# EAGLE design tdr (EAGLE 9.1.1)
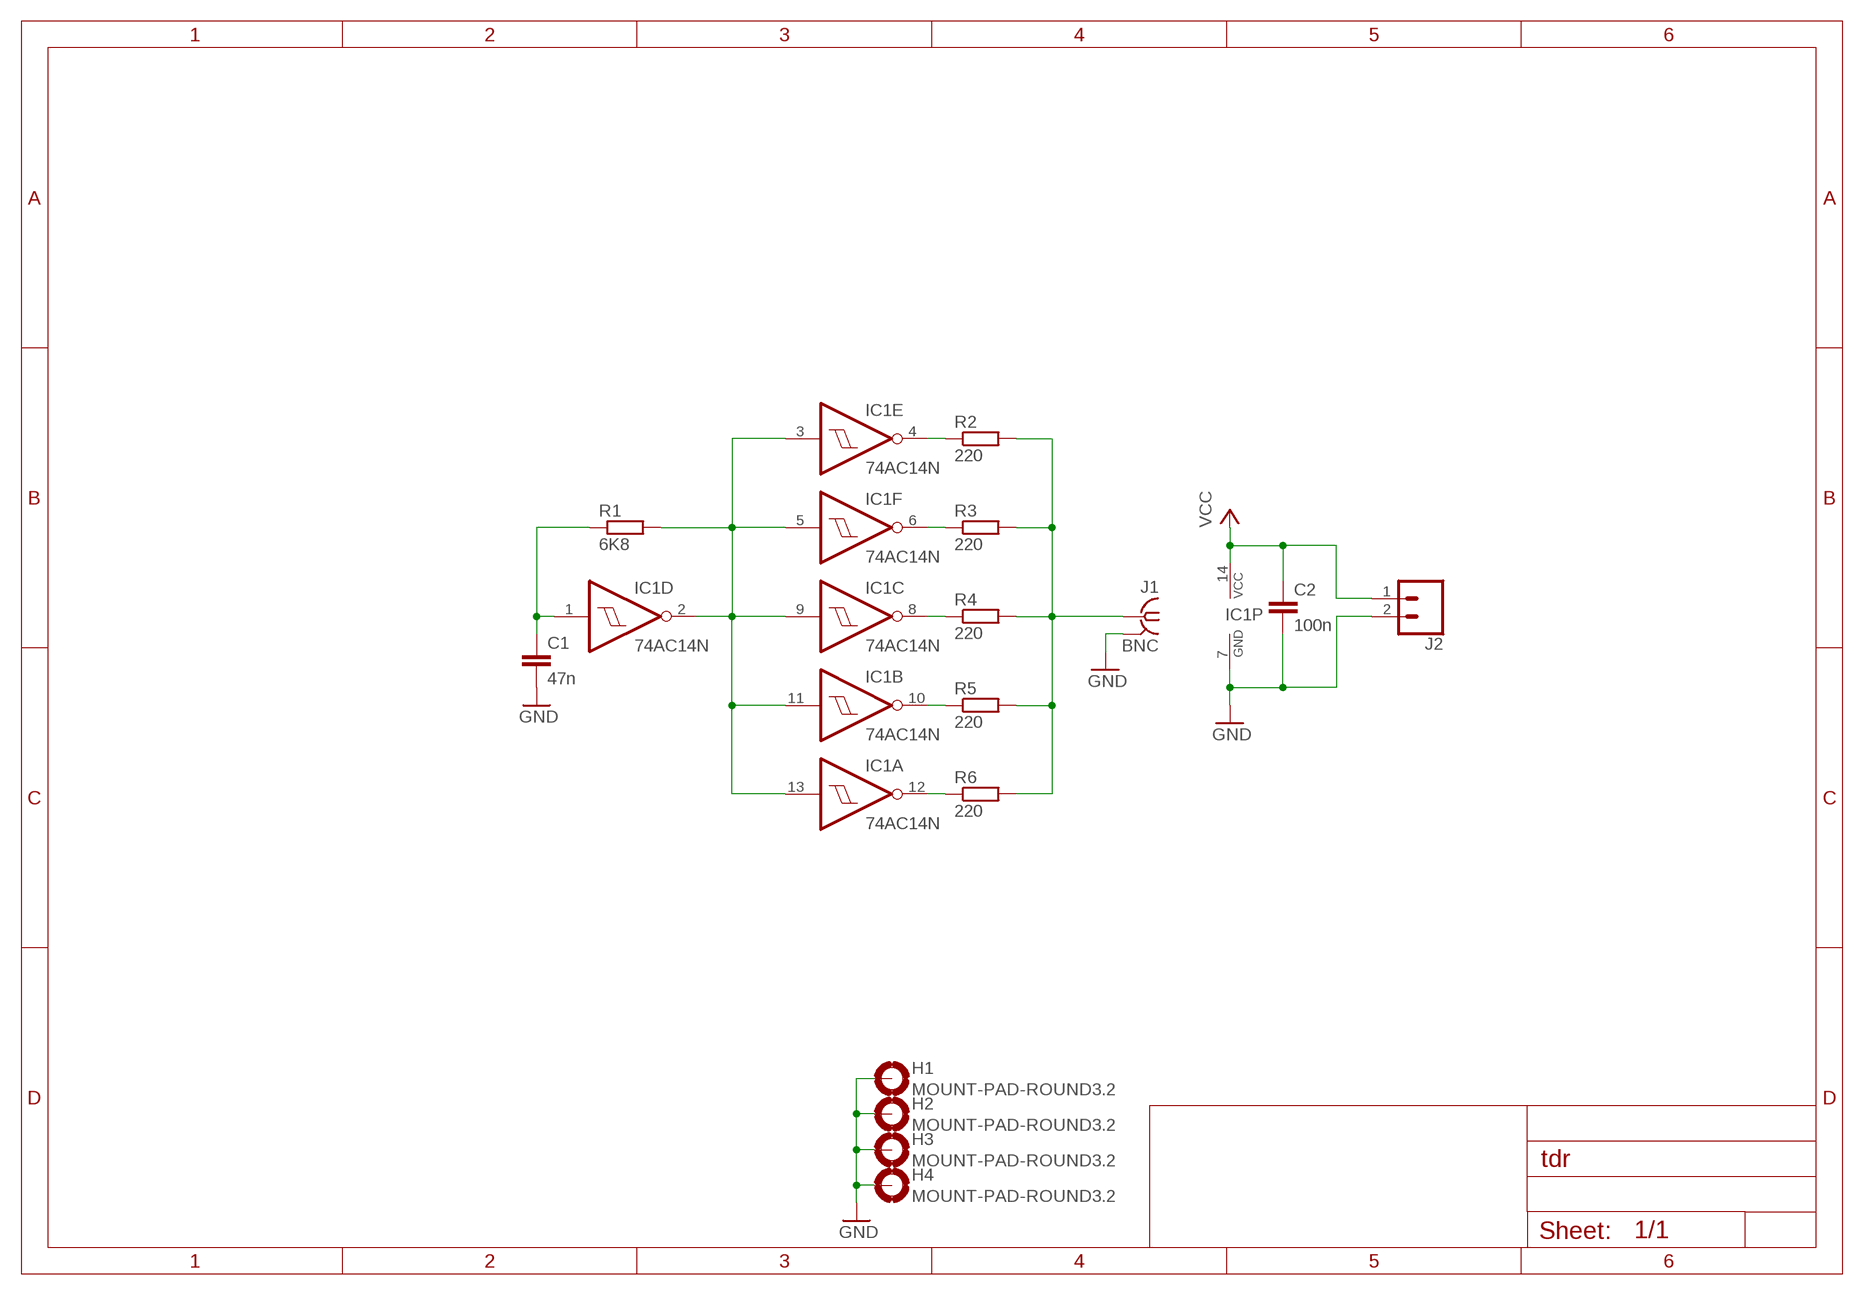
[diagram p0: schematic, sheet 1]

## Parts
C1  47n  C-EU075-032X103  [C075-032X103]
C2  100n  C-EU075-032X103  [C075-032X103]
H1  MOUNT-PAD-ROUND3.2  [3,2-PAD]
H2  MOUNT-PAD-ROUND3.2  [3,2-PAD]
H3  MOUNT-PAD-ROUND3.2  [3,2-PAD]
H4  MOUNT-PAD-ROUND3.2  [3,2-PAD]
IC1  74AC14N  [DIL14]
J1  BNC  [BNC_TYCO]
J2  CONN_023.5MM  [SCREWTERMINAL-3.5MM-2]
R1  6K8  R-EU_0207/10  [0207/10]
R2  220  R-EU_0207/10  [0207/10]
R3  220  R-EU_0207/10  [0207/10]
R4  220  R-EU_0207/10  [0207/10]
R5  220  R-EU_0207/10  [0207/10]
R6  220  R-EU_0207/10  [0207/10]

## Nets
GND: C1.2 C2.2 H1.B3,2(MOUNT) H2.B3,2(MOUNT) H3.B3,2(MOUNT) H4.B3,2(MOUNT) IC1.7(P:GND) J1.G(GND) J2.2
N$1: C1.1 IC1.1(D:I) R1.1
N$2: IC1.2(D:O) IC1.3(E:I) IC1.5(F:I) IC1.9(C:I) IC1.11(B:I) IC1.13(A:I) R1.2
N$3: IC1.4(E:O) R2.1
N$4: IC1.6(F:O) R3.1
N$5: IC1.8(C:O) R4.1
N$6: IC1.10(B:O) R5.1
N$7: IC1.12(A:O) R6.1
N$8: J1.C R2.2 R3.2 R4.2 R5.2 R6.2
VCC: C2.1 IC1.14(P:VCC) J2.1

## Library data of the parts
C1 C2 = rcl:C-EU: CAPACITOR, European symbol; SPICEPREFIX: C
H1-H4 = AZT-HOLES:MOUNT-PAD-ROUND: MOUNTING PAD, round
IC1 = 74xx-eu:74*14: Hex schmitt trigger INVERTER
J1 = AZT-RF:BNC
J2 = AZT-CONN:CONN_02: Multi connection point. Often used as Generic Header-pin footprint for 0.1 inch spaced/style header connections On any of the 0.1 inch spaced packages, you can populate with these: Break Away Headers - Straight <https://www.sparkfun.com/products/116> (PRT-00116) Break Away Male Headers - Right Angle <https://www.sparkfun.com/products/553> (PRT-00553) Female Headers <https://www.sparkfun.com/products/115> (PRT-00115) Break Away Headers - Machine Pin <https://www.sparkfun.com/products/117> (PRT-00117) Break Away Female Headers - Swiss Machine Pin <https://www.sparkfun.com/products/743> (PRT-00743) For SCREWTERMINALS and SPRING TERMINALS visit here: Screw Terimnals on SparkFun.com <https://www.sparkfun.com/search/results?term=Screw+Terminals> (5mm/3.5mm/2.54mm spacing) This device is also useful as a general connection point to wire up your design to another part of your project. Our various solder wires solder well into these plated through hole pads. Hook-Up Wire - Assortment (Stranded, 22 AWG) <https://www.sparkfun.com/products/11375> (PRT-11375) Hook-Up Wire - Assortment (Solid Core, 22 AWG) <https://www.sparkfun.com/products/11367> (PRT-11367) View the entire wire category on our website here <https://www.sparkfun.com/categories/141> Special notes: Molex polarized connector foot print use with: PRT-08233 with associated crimp pins and housings. 2.54_SCREWTERM for use with PRT-10571. 3.5mm Screw Terminal footprints for PRT-08084 5mm Screw Terminal footprints for use with PRT-08432; PROD_ID: CONN-08399
R1-R6 = rcl:R-EU_: RESISTOR, European symbol; SPICEPREFIX: R

## Board
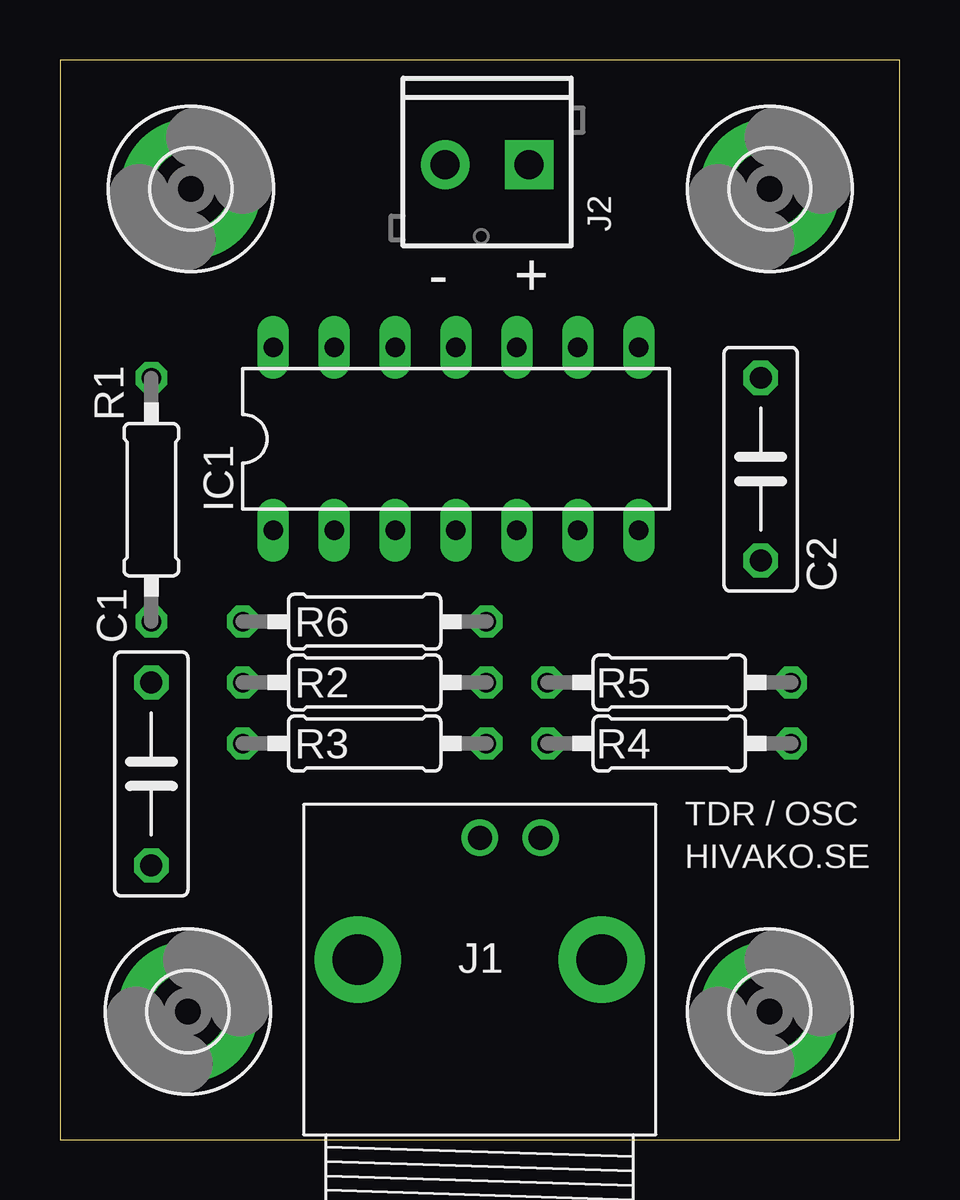
[diagram p1: board, top side]
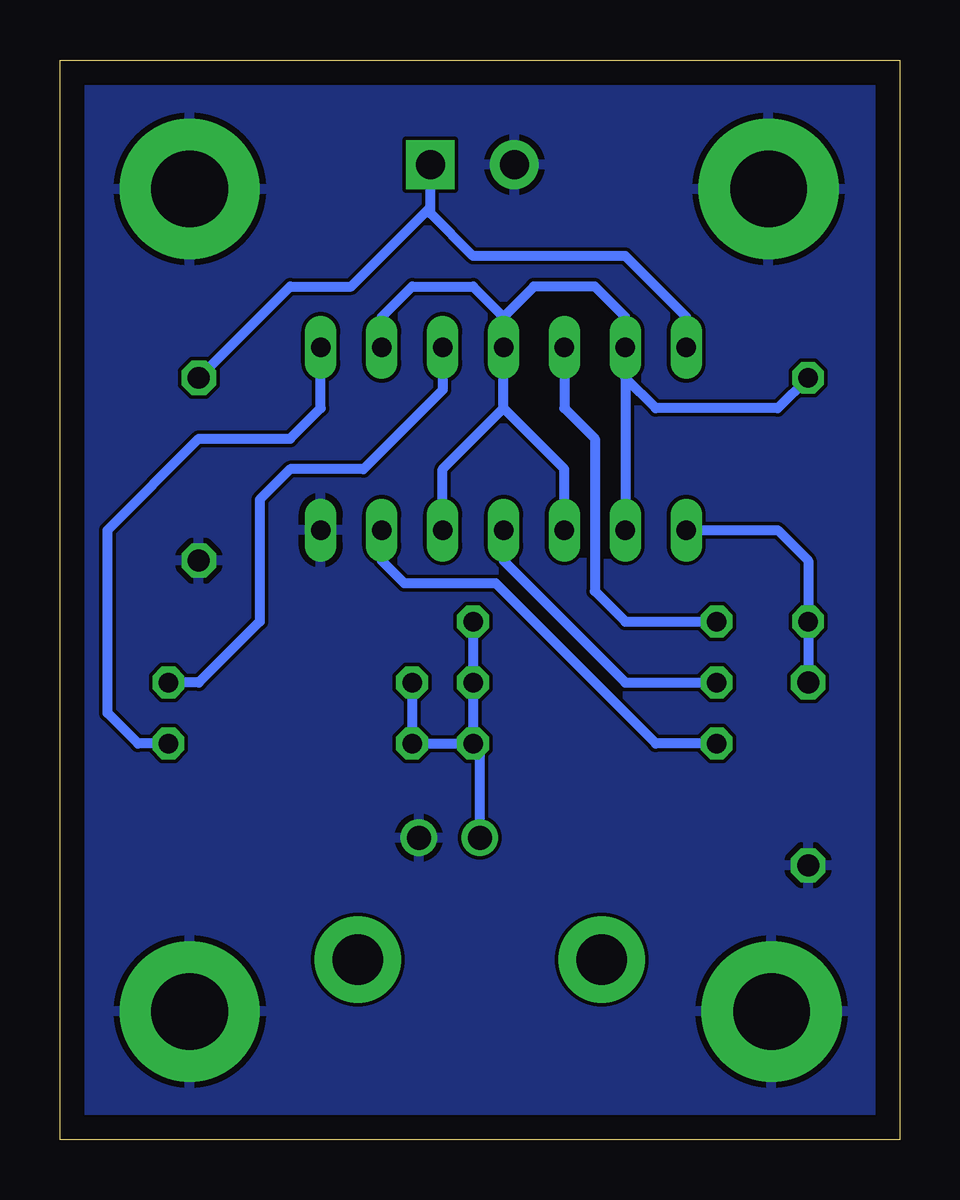
[diagram p2: board, bottom side, seen from below]

Size 35 x 45 mm. Coordinates in mm from the lower left corner, seen from the top.
Outline: 0,0 35,0 35,45 0,45 0,0
Copper layers (1*16): Top 0.035mm / dielectric 1.5mm / Bottom 0.035mm
Design rules "default": minimum track width 6mil, minimum drill 0.35mm, track to track 6mil, track to pad 6mil, pad to pad 6mil, via to via 6mil, smd to smd 6mil, copper to edge 40mil, drill to drill 6mil, minimum pad ring 10mil, minimum via ring 8mil, stop-mask expansion 4mil, vias tented up to drill 0mil, thermal gap 10mil

### Footprints (pad centres in the part's own frame; a part is rotated, then mirrored left to right if it is on the bottom)
C075-032X103 = drill 0.914 octagon: 1 -3.81,0; 2 3.81,0
3,2-PAD = drill 3.2 pad 5.842: B3,2 0,0
DIL14 = drill 0.813 long: 1 -7.62,-3.81; 2 -5.08,-3.81; 3 -2.54,-3.81; 4 0,-3.81; 5 2.54,-3.81; 6 5.08,-3.81; 7 7.62,-3.81; 8 7.62,3.81; 9 5.08,3.81; 10 2.54,3.81; 11 0,3.81; 12 -2.54,3.81; 13 -5.08,3.81; 14 -7.62,3.81
BNC_TYCO = drill 2.1 pad 3.6: 3 -5.08,0; 4 5.08,0 | drill 1: C 0,5.08; G 2.54,5.08
SCREWTERMINAL-3.5MM-2 = drill 1.2 pad 2.032 square: 1 0,0 | drill 1.2 pad 2.032: 2 3.5,0
0207/10 = drill 0.813 octagon: 1 -5.08,0; 2 5.08,0

### Placement (x,y rotation side)
C1  3.81,15.24 270 top
C2  29.21,27.94 270 top
H1  5.33,5.33 0 top
H2  29.59,5.33 0 top
H3  29.59,39.62 0 top
H4  5.46,39.62 0 top
IC1  16.51,29.21 0 top
J1  17.5,7.5 0 top
J2  19.56,40.64 180 top
R1  3.81,26.67 90 top
R2  12.7,19.05 0 top
R3  12.7,16.51 0 top
R4  25.4,16.51 180 top
R5  25.4,19.05 180 top
R6  12.7,21.59 0 top

### Tracks (layer width: path | path; a pad name or v marks a point on that pad's centre or on a via)
GND
  pour Bottom: 0,44.45 35.56,44.45 35.56,0 0,0
N$1
  Bottom 0.406: IC1.1 5.08,25.4 3.81,24.13 R1.1 C1.1
N$2
  Bottom 0.406: R1.2 5.08,30.48 10.16,30.48 11.43,31.75 IC1.13 | IC1.13 IC1.2 | IC1.13 11.43,34.29 12.7,35.56 15.24,35.56 16.51,34.29 | 16.51,34.29 IC1.11 16.51,30.48 | IC1.9 21.59,34.29 20.32,35.56 17.78,35.56 16.51,34.29 | IC1.5 19.05,27.94 16.51,30.48 | IC1.3 13.97,27.94 16.51,30.48
N$3
  Bottom 0.406: R2.1 10.16,19.05 11.43,19.05 16.51,24.13 IC1.4
N$4
  Bottom 0.406: IC1.6 21.59,24.13 20.64,23.18 16.83,23.18 10.16,16.51 R3.1
N$5
  Bottom 0.406: R4.1 31.75,16.51 33.02,17.78 33.02,25.4 29.21,29.21 25.4,29.21 24.13,30.48 IC1.8
N$6
  Bottom 0.406: R5.1 29.21,19.05 26.67,21.59 26.67,26.67 25.4,27.94 22.35,27.94 19.05,31.24 IC1.10
N$7
  Bottom 0.406: R6.1 11.43,21.59 12.7,22.86 12.7,29.21 13.97,30.48 IC1.12
N$8
  Bottom 0.406: R6.2 R2.2 R3.2 | R5.2 R4.2 R3.2 | J1.C 17.5,16.23 R3.2
VCC
  Bottom 0.406: IC1.14 8.89,34.29 11.43,36.83 17.78,36.83 19.56,38.61 19.56,38.86 | C2.1 25.4,35.56 22.86,35.56 19.56,38.86 | 19.56,38.86 J2.1

### Text on the board
tPlace: - | + | TDR / OSC | HIVAKO.SE